# EasyEDA Pro project ProDoc_ICM_2025-08-29.epro, schematic Schematic1
Board Name: ICM; Create Date: 2025-08-23; Page Name: P1; Project Name: ICM module; Schematic Name: Schematic1; Update Date: 2025-08-24; Company: EasyEDA.com; Page Size: A4; Version: V1.0
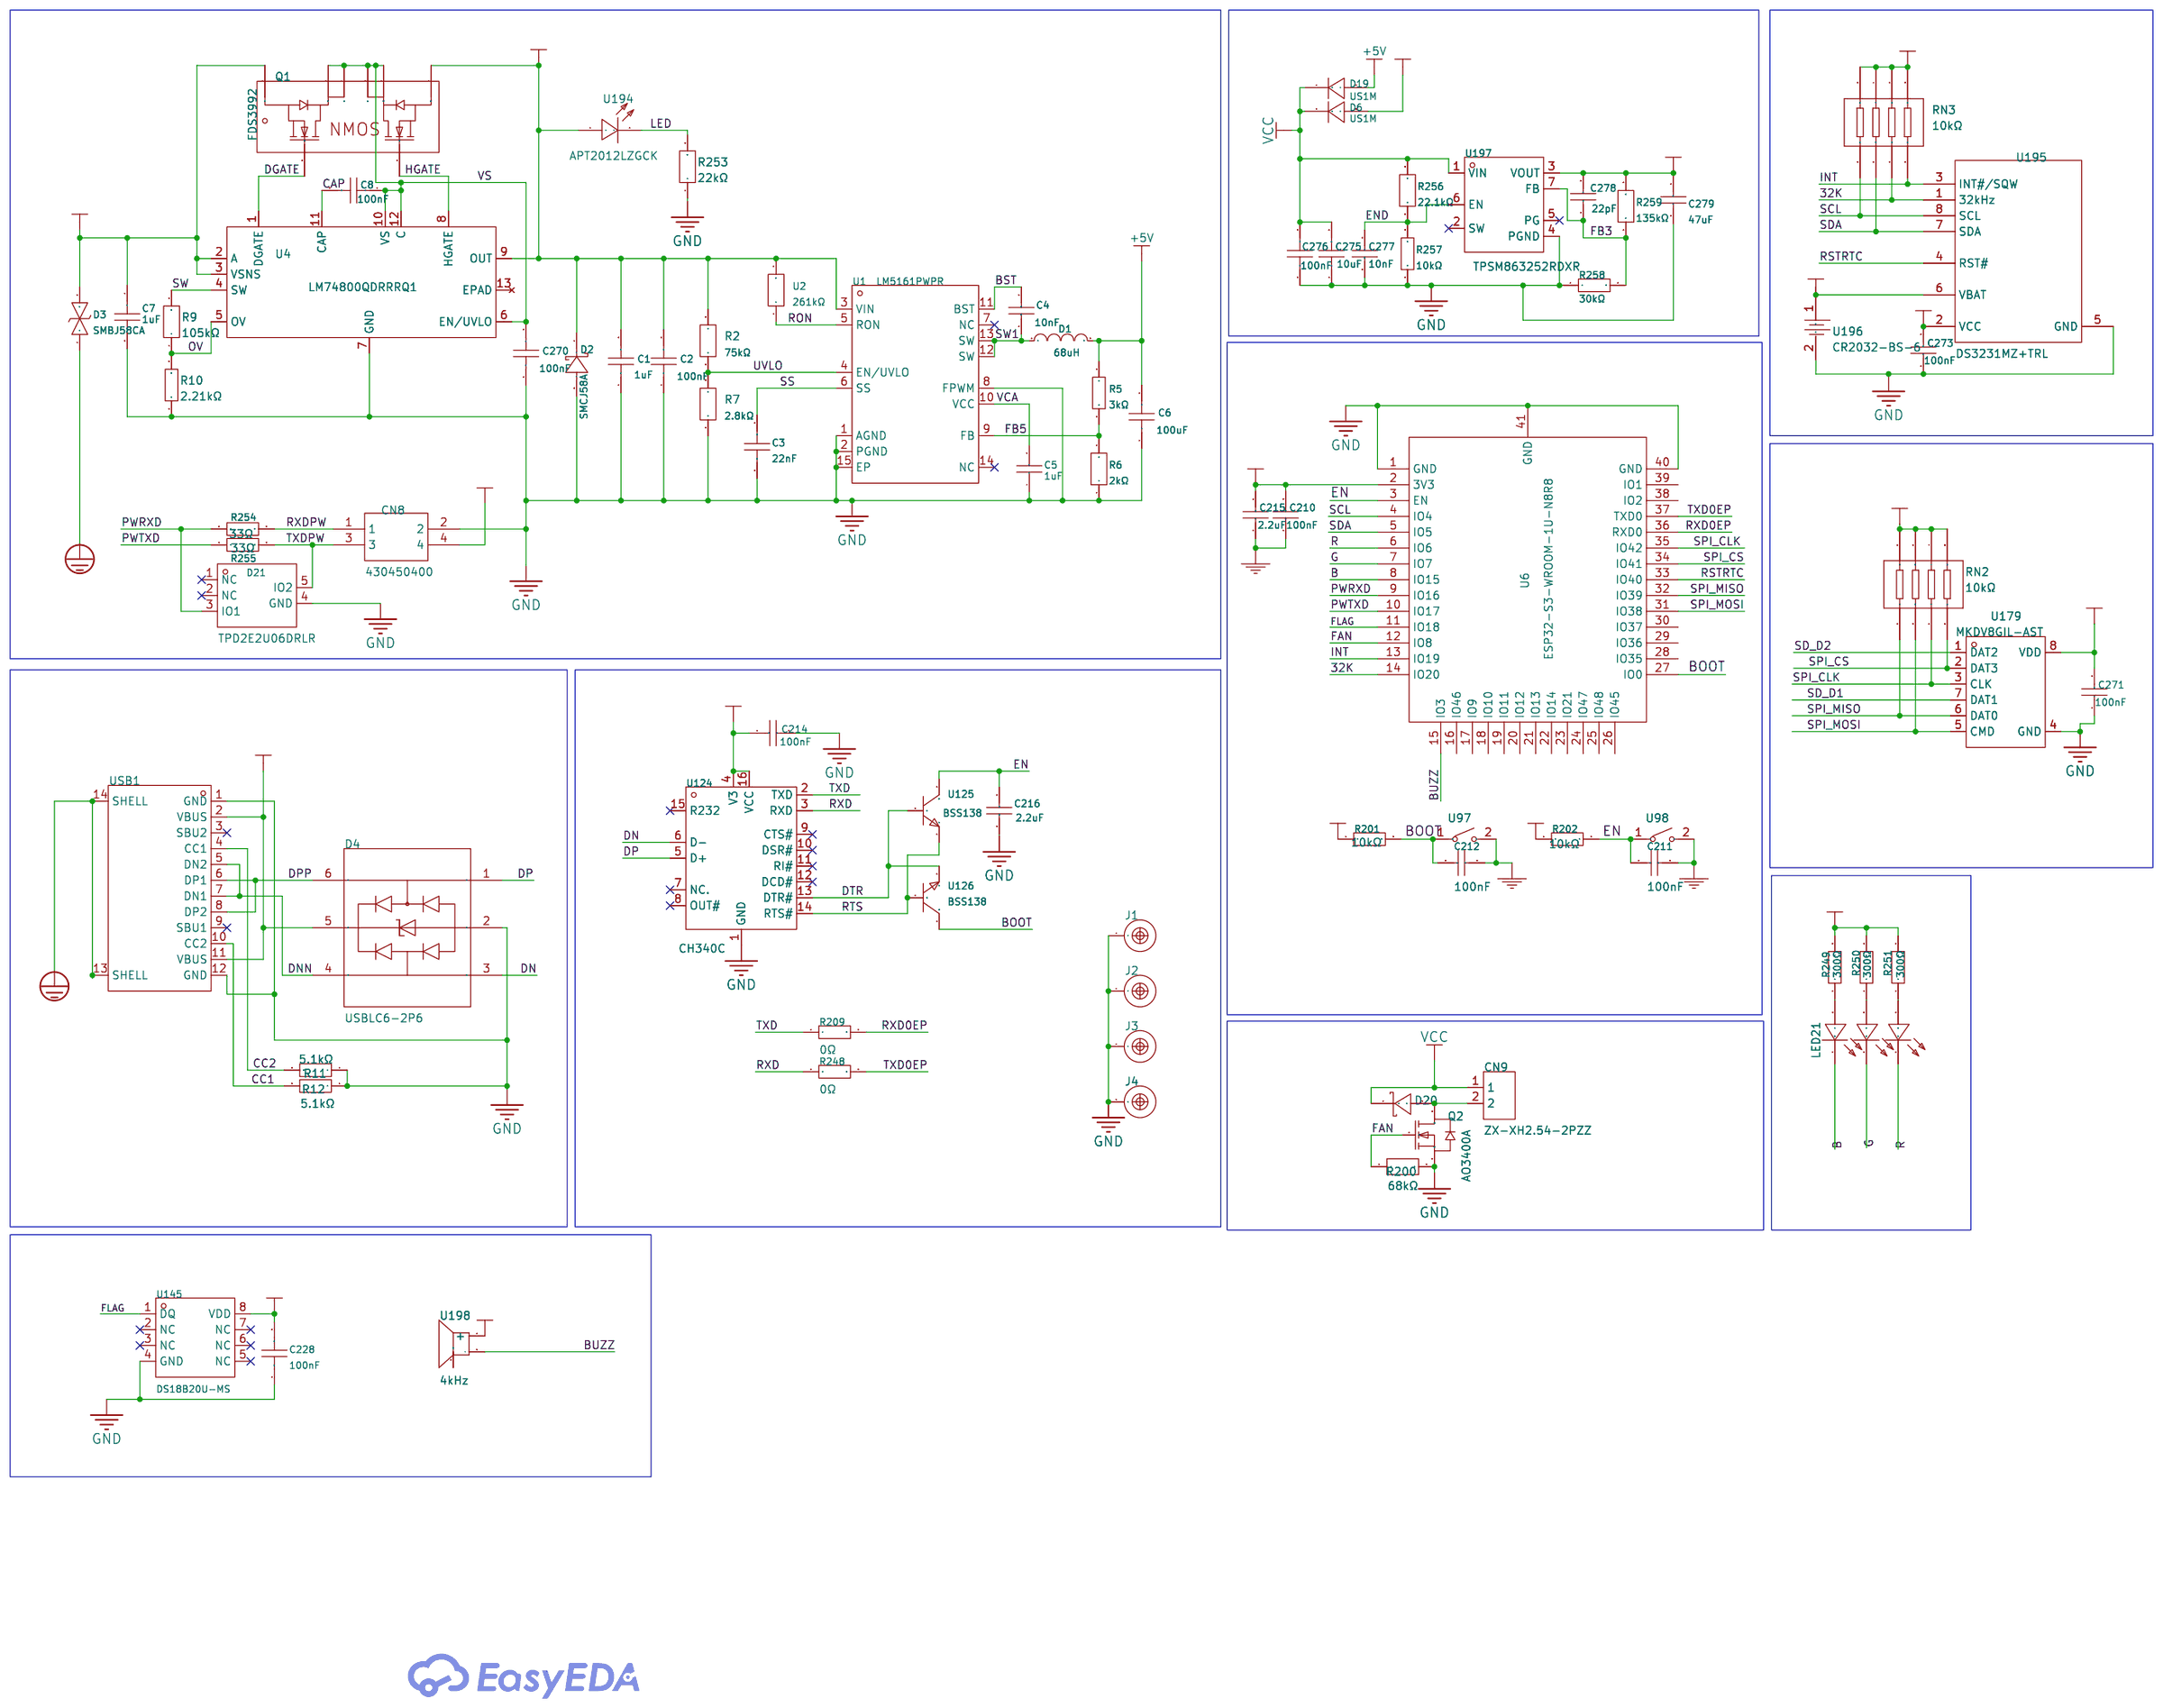
[diagram p0: schematic sheet]

## Parts
C1  1uF  [C2220]
C2  100nF  [C1210]
C3  22nF  [C0805]
C4  10nF  [C0402]
C5  1uF  [C0603]
C6  100uF  [C1210]
C7  1uF  [C2220]
C8  100nF  [C1210]
C210  100nF  [C0805]
C211  100nF  [C0805]
C212  100nF  [C0805]
C214  100nF  [C0805]
C215  2.2uF  [C0805]
C216  2.2uF  [C0805]
C228  100nF  [C0805]
C270  100nF  [C1210]
C271  100nF  [C0805]
C273  100nF  [C0805]
C275  10uF  [C0805]
C276  100nF  [C0402]
C277  10nF  [C0201]
C278  22pF  [C0201]
C279  47uF  [C1210]
CN8  430450400  [CONN-TH_0430450400]
CN9  ZX-XH2.54-2PZZ  [CONN-TH_2P-P2.50_HX25003-2A]
D1  68uH  [IND-SMD_L12.5-W12.5-SRR1280-150M]
D2  SMCJ58A  [SMC_L6.9-W5.8-LS7.9-RD]
D3  SMBJ58CA  [SMB_L4.6-W3.6-LS5.3-BI]
D4  USBLC6-2P6  [SOT-666-6_L1.6-W1.2-P0.50-LS1.6-BR]
D6  US1M  [SMA_L4.4-W2.8-LS5.4-RD]
D19  US1M  [SMA_L4.4-W2.8-LS5.4-RD]
D20  BAT46WJ,115  [SOD-323F_L2.0-W1.6-LS2.5-RD]
D21  TPD2E2U06DRLR  [SOT-553-5_L1.6-W1.2-P0.50-LS1.6-TL-1]
J1  SCREW-MOUNTING-HOLE-3MM  [MountingHole:MountingHole_2.7mm_M2.5_Pad_Via]
J2  SCREW-MOUNTING-HOLE-3MM  [MountingHole:MountingHole_2.7mm_M2.5_Pad_Via]
J3  SCREW-MOUNTING-HOLE-3MM  [MountingHole:MountingHole_2.7mm_M2.5_Pad_Via]
J4  SCREW-MOUNTING-HOLE-3MM  [MountingHole:MountingHole_2.7mm_M2.5_Pad_Via]
LED21  HL-AF-5060H271BU46FU79GC-S1-THL  [LED-ARRAY-SMD_6P-L5.4-W5.0-TL-FD]
Q1  FDS3992  [SO-8_L4.9-W3.9-P1.27-LS5.9-BL]
Q2  AO3400A  [SOT-23-3_L2.9-W1.6-P1.90-LS2.8-BR]
R2  75kΩ  [R1210]
R5  3kΩ  [R0603]
R6  2kΩ  [R0402]
R7  2.8kΩ  [R1210]
R9  105kΩ  [R1206]
R10  2.21kΩ  [R1206]
R11  5.1kΩ  [R0805]
R12  5.1kΩ  [R0805]
R200  68kΩ  [R1206]
R201  10kΩ  [R0805]
R202  10kΩ  [R0805]
R209  0Ω  [R0805]
R248  0Ω  [R0805]
R249  300Ω  [R0805]
R250  300Ω  [R0805]
R251  300Ω  [R0805]
R253  22kΩ  [R1210]
R254  33Ω  [R0805]
R255  33Ω  [R0805]
R256  22.1kΩ  [R0402]
R257  10kΩ  [R0402]
R258  30kΩ  [R0603]
R259  135kΩ  [R0603]
RN2  10kΩ  [RES-ARRAY-SMD_0603-8P-L3.2-W1.6-BL]
RN3  10kΩ  [RES-ARRAY-SMD_0603-8P-L3.2-W1.6-BL]
U1  LM5161PWPR  [HTSSOP-14_L5.0-W4.4-P0.65-LS6.4-BL-EP3.0]
U2  261kΩ  [R0402]
U4  LM74800QDRRRQ1  [WSON-12_L3.0-W3.0-P0.50-TL-EP-2]
U6  ESP32-S3-WROOM-1U-N8R8  [WIRELM-SMD_ESP32-S3-WROOM-1U]
U97  TD-1183SN-1.7H-250  [KEY-SMD_L3.0-W2.5-LS4.0]
U98  TD-1183SN-1.7H-250  [KEY-SMD_L3.0-W2.5-LS4.0]
U124  CH340C  [SOP-16_L10.0-W3.9-P1.27-LS6.0-BL]
U125  BSS138  [SOT-23-3_L2.9-W1.6-P1.90-LS2.8-BR]
U126  BSS138  [SOT-23-3_L2.9-W1.6-P1.90-LS2.8-BR]
U145  DS18B20U-MS  [MSOP-8_L3.0-W3.0-P0.65-LS4.9-BL-1]
U179  MKDV8GIL-AST  [LGA-8_L6.0-W8.0-P1.27-TL]
U194  APT2012LZGCK  [LED-SMD_L2.0-W1.3-R-RD]
U195  DS3231MZ+TRL  [SOIC-8_L4.9-W3.9-P1.27-LS6.0-BL]
U196  CR2032-BS-6  [BAT-TH_CR2032-BS-6-1]
U197  TPSM863252RDXR  [QFN-7_L4.0-W3.3_TPSM863257RDXR]
U198  4kHz  [BUZ-SMD_3P_L5.0-W5.0-P3.50-TL]
USB1  TYPE-C 16PIN 2MD(073)  [USB-C-SMD_TYPE-C-6PIN-2MD-073]

## Library data of the parts
C1 C7 = GRM55DR72E105KW01L: Capacitance: Tolerance:±10% Tolerance:±10% Voltage Rated: Temperature Coefficient:; LCSC Part Name: 1uF ±10% 250V; Supplier Part: C489791; Manufacturer: muRata(村田); Supplier Footprint: 2220; JLCPCB Part Class: Extended Part; Datasheet: https://atta.szlcsc.com/upload/public/pdf/source/20200303/C489791_21819A01F8644F985297DAC22D62BF33.pdf; Supplier: LCSC; Tolerance: ±10%
C2 C8 C270 = CC1210KKX7RYBB104: Capacitance: Tolerance:±10% Tolerance:±10% Voltage Rated: Temperature Coefficient:; LCSC Part Name: 100nF ±10% 250V; Supplier Part: C527381; Manufacturer: YAGEO(国巨); Supplier Footprint: 1210; JLCPCB Part Class: Extended Part; Datasheet: https://atta.szlcsc.com/upload/public/pdf/source/20200508/C527381_FB64CFF56C74B71B8CBBB2E2D2FF56B0.pdf; Supplier: LCSC; Tolerance: ±10%
C3 = CC0805KRX7R7BB223: Capacitance: Tolerance:±10% Tolerance:±10% Voltage Rated: Temperature Coefficient:; LCSC Part Name: 22nF ±10% 16V; Supplier Part: C519961; Manufacturer: YAGEO(国巨); Supplier Footprint: 0805; JLCPCB Part Class: Extended Part; Datasheet: https://atta.szlcsc.com/upload/public/pdf/source/20200423/C519961_BCF55CFF7AF7FA8FAC393D5C8451BEF7.pdf; Supplier: LCSC; Tolerance: ±10%
C4 = GRM155R71H103KA88D: Capacitance: Tolerance:±10% Tolerance:±10% Voltage Rated: Temperature Coefficient:; LCSC Part Name: 10nF ±10% 50V; Supplier Part: C77019; Manufacturer: muRata(村田); Supplier Footprint: 0402; JLCPCB Part Class: Extended Part; Datasheet: https://atta.szlcsc.com/upload/public/pdf/source/20180326/C77019_6A3693CE1BCE757D6A8B7C99DAE1B441.pdf; Supplier: LCSC; Tolerance: ±10%
C5 = EMK107B7105KA-T: Capacitance:1uF Tolerance:±10% Tolerance:±10% Voltage Rating:16V Temperature Coefficient:X7R; LCSC Part Name: MSASE168SB7105KTNA01 1uF ±10% 16V; Supplier Part: C92759; Manufacturer: TAIYO YUDEN(太诱); Supplier Footprint: 0603; JLCPCB Part Class: Extended Part; Datasheet: https://item.szlcsc.com/datasheet/EMK107B7105KA-T/93953.html; Supplier: LCSC; Tolerance: ±10%; Voltage Rating: 16V; Temperature Coefficient: X7R
C6 = GRM32ER60J107ME20L_C88154: Capacitance: Tolerance:±20% Tolerance:±20% Voltage Rated: Temperature Coefficient:; LCSC Part Name: 100uF ±20% 6.3V; Supplier Part: C88154; Manufacturer: muRata(村田); Manufacturer Part: GRM32ER60J107ME20L; Supplier Footprint: 1210; JLCPCB Part Class: Extended Part; Datasheet: https://atta.szlcsc.com/upload/public/pdf/source/20170116/1484561244372.pdf; Supplier: LCSC; Tolerance: ±20%
C210-C212 C214 C271 C273 = 0805B104K500NT: Capacitance:100nF Tolerance:±10% Tolerance:±10% Voltage Rated: Temperature Coefficient:; LCSC Part Name: 100nF ±10% 50V; Supplier Part: C38141; Manufacturer: FH(风华); Supplier Footprint: 0805; JLCPCB Part Class: Extended Part; Datasheet: https://atta.szlcsc.com/upload/public/pdf/source/20200305/C486355_26A10D38EF8C2A5C37091D0039909270.pdf; Supplier: LCSC; Tolerance: ±10%
C215 C216 = CL21B225KAFNNNE: Capacitance: Tolerance:±10% Tolerance:±10% Voltage Rated: Temperature Coefficient:; LCSC Part Name: 2.2uF ±10% 25V; Supplier Part: C19110; Manufacturer: SAMSUNG(三星); Supplier Footprint: 0805; JLCPCB Part Class: Extended Part; Datasheet: https://atta.szlcsc.com/upload/public/pdf/source/20160218/1457707763339.pdf; Supplier: LCSC; Tolerance: ±10%
C228 = GCM21BR71H104KA37K: Capacitance:0.1uF Tolerance:±10% Tolerance:±10% Voltage Rating:50V Temperature Coefficient:X7R; LCSC Part Name: 100nF ±10% 50V; Supplier Part: C28233; Manufacturer: muRata(村田); Supplier Footprint: 0805; JLCPCB Part Class: Extended Part; Datasheet: https://atta.szlcsc.com/upload/public/pdf/source/20230811/01F8D1403046F5B0772D3592B1B0BAA0.pdf; Supplier: LCSC; Tolerance: ±10%; Voltage Rating: 50V; Temperature Coefficient: X7R
C275 = C0805C106K8PACTU: Capacitance: Tolerance:±10% Tolerance:±10% Voltage Rated: Temperature Coefficient:; LCSC Part Name: 10uF ±10% 10V; Supplier Part: C2167673; Manufacturer: KEMET(基美); Supplier Footprint: 0805; JLCPCB Part Class: Extended Part; Datasheet: https://atta.szlcsc.com/upload/public/pdf/source/20210601/F69F25D6FEA5EB3D7C122B835EA50B80.pdf; Supplier: LCSC; Tolerance: ±10%
C276 = GRM155R71A104KA01D: Capacitance: Tolerance:±10% Tolerance:±10% Voltage Rated: Temperature Coefficient:; LCSC Part Name: 100nF ±10% 10V; Supplier Part: C71687; Manufacturer: muRata(村田); Supplier Footprint: 0402; JLCPCB Part Class: Extended Part; Datasheet: https://atta.szlcsc.com/upload/public/pdf/source/20180228/C71687_15198055953951377607.pdf; Supplier: LCSC; Tolerance: ±10%
C277 = GRM033R70J103KA01D: Capacitance: Tolerance:±10% Tolerance:±10% Voltage Rated: Temperature Coefficient:; LCSC Part Name: 10nF ±10% 6.3V; Supplier Part: C76940; Manufacturer: muRata(村田); Supplier Footprint: 0201; JLCPCB Part Class: Extended Part; Datasheet: https://atta.szlcsc.com/upload/public/pdf/source/20180307/C76940_15204091030811407728.pdf; Supplier: LCSC; Tolerance: ±10%
C278 = GRM0335C1E220JA01D: Capacitance: Tolerance:±5% Tolerance:±5% Voltage Rated: Temperature Coefficient:; LCSC Part Name: 22pF ±5% 25V; Supplier Part: C76919; Manufacturer: muRata(村田); Supplier Footprint: 0201; JLCPCB Part Class: Extended Part; Datasheet: https://atta.szlcsc.com/upload/public/pdf/source/20180307/C76919_15204090858141407709.pdf; Supplier: LCSC; Tolerance: ±5%
C279 = GRM32ER71A476KE15L: Capacitance: Tolerance:±10% Tolerance:±10% Voltage Rated: Temperature Coefficient:; LCSC Part Name: 47uF ±10% 10V; Supplier Part: C84494; Manufacturer: muRata(村田); Supplier Footprint: 1210; JLCPCB Part Class: Extended Part; Datasheet: https://atta.szlcsc.com/upload/public/pdf/source/20161226/1482720144456.pdf; Supplier: LCSC; Tolerance: ±10%
CN8 = 430450400_C122413: Pins Structure:2x2P Pitch:3mm Mounting Type:Right Angle Reference Series:Micro-Fit(MX 3.0) Number of Pins:4P Number of Rows:2 Number of PINs Per Row:2 Row Spacing:3mm Current Rating:8.5A Contact Material:Brass Contact Plating:Tin Operating Temperature:-40; LCSC Part Name: 2x2P 间距:3mm 弯插 系列:Micro-Fit(MX 3.0); Supplier Part: C122413; Manufacturer: MOLEX; Supplier Footprint: 弯插,P=3mm; JLCPCB Part Class: Extended Part; Datasheet: https://www.molex.com/content/dam/molex/molex-dot-com/products/automated/en-us/salesdrawingpdf/430/43045/430450400_sd.pdf?inline\; Supplier: LCSC; Pins Structure: 2x2P; Pitch: 3mm; Mounting Type: Right Angle; Reference Series: Micro-Fit(MX 3.0); Number of Pins: 4P; Number of Rows: 2; Number of PINs Per Row: 2; Row Spacing: 3mm; Current Rating: 8.5A; Contact Material: Brass; Contact Plating: Tin; Operating Temperature: -40℃~+105℃; Voltage Rating: 600V; Flame Retardant Rating: UL94V-0; Supplementary Features: Harpoon Contact (Plastic); Color: Black; Z-Height of the Board: 8.77mm; X-Length of Bottom Edge on Board (Spacing Line): 9.65mm; Y-Width of Bottom Edge on Board: 12.24mm
CN9 = ZX-XH2.54-2PZZ: Pins Structure:1x2P Pitch:2.5mm Mounting Type:Through Hole Reference Series:XH Number of Pins:2P Number of Rows:1 Number of PINs Per Row:2 Row Spacing:- Current Rating:3A Contact Material:Brass Contact Plating:Tin Operating Temperature:-25℃~+85℃ Operating; LCSC Part Name: 1x2P 间距:2.5mm 直插 系列:XH; Supplier Part: C7429632; Manufacturer: Megastar(兆星); Supplier Footprint: 插件,P=2.5mm; JLCPCB Part Class: Extended Part; Datasheet: https://item.szlcsc.com/datasheet/ZX-XH2.54-2PZZ/8427549.html; Supplier: LCSC; Pins Structure: 1x2P; Pitch: 2.5mm; Mounting Type: Through Hole; Reference Series: XH; Number of Pins: 2P; Number of Rows: 1; Number of PINs Per Row: 2; Current Rating: 3A; Contact Material: Brass; Contact Plating: Tin; Operating Temperature: -25℃~+85℃; Voltage Rating: 250V; Plastic Material: PA66; Flame Retardant Rating: UL94V-0; Color: White; Z-Height of the Board: 7mm; X-Length of Bottom Edge on Board (Spacing Line): 7.5mm; Y-Width of Bottom Edge on Board: 5.9mm
D1 = SRR1260-680M: Inductance:68uH Tolerance:±20% Tolerance:±20% Current Rating:2.1A Current - Saturation(Isat):2.1A DC Resistance(DCR):110mΩ Type:- Ratings:-; LCSC Part Name: 68uH ±20% 2.1A; Supplier Part: C2041353; Manufacturer: BOURNS; Supplier Footprint: SMD,12.5x12.5mm; JLCPCB Part Class: Extended Part; Datasheet: https://item.szlcsc.com/datasheet/SRR1260-680M/2132916.html; Supplier: LCSC; Tolerance: ±20%; Current Rating: 2.1A; Current - Saturation(Isat): 2.1A; DC Resistance(DCR): 110mΩ
D2 = SMCJ58A_C42371547: Polarity:Unidirectional Reverse Stand-Off Voltage (Vrwm):58V Clamping Voltage:93.6V Peak Pulse Current (Ipp):16.1A Peak Pulse Power Dissipation (Ppp):1.5kW Voltage - Breakdown:71.2V Reverse Leakage Current (Ir):1uA Operating Temperature:-55℃~+150℃ Operati; LCSC Part Name: 1500W 表面贴装瞬态电压抑制器; Supplier Part: C42371547; Manufacturer: 宏嘉诚; Supplier Footprint: SMC(DO-214AB); JLCPCB Part Class: Extended Part; Datasheet: https://item.szlcsc.com/datasheet/SMCJ58A/44252474.html; Supplier: LCSC; Polarity: Unidirectional; Reverse Stand-Off Voltage (Vrwm): 58V; Clamping Voltage: 93.6V; Peak Pulse Current (Ipp): 16.1A; Peak Pulse Power Dissipation (Ppp): 1.5kW; Voltage - Breakdown: 71.2V; Reverse Leakage Current (Ir): 1uA; Operating Temperature: -55℃~+150℃; level of protection: IEC 61000-4-2; Type: TVS
D3 = SMBJ58CA_C440309: Polarity:Bidirectional Reverse Stand-Off Voltage (Vrwm):58V Clamping Voltage:93.6V Peak Pulse Current (Ipp):6.4A Peak Pulse Power Dissipation (Ppp):600W@10/1000us Voltage - Breakdown:64.4V Reverse Leakage Current (Ir):5uA Operating Temperature:-55℃~+150℃; LCSC Part Name: 双向TVS 58V截止 峰值浪涌电流：6.4A; Supplier Part: C440309; Manufacturer: AnBon(安邦); Supplier Footprint: SMB(DO-214AA); JLCPCB Part Class: Extended Part; Datasheet: https://item.szlcsc.com/datasheet/SMBJ58CA/439717.html; Supplier: LCSC; Polarity: Bidirectional; Reverse Stand-Off Voltage (Vrwm): 58V; Clamping Voltage: 93.6V; Peak Pulse Current (Ipp): 6.4A; Peak Pulse Power Dissipation (Ppp): 600W@10/1000us; Voltage - Breakdown: 64.4V; Reverse Leakage Current (Ir): 5uA; Operating Temperature: -55℃~+150℃; Type: TVS
D4 = USBLC6-2P6_C15999: polarity:Unidirectional Reverse Stand-Off Voltage (Vrwm):5.25V Maximum Clamping Voltage:17V Peak Pulse Current (Ipp):5A Breakdown Voltage:6V Number of Lines:Dual channel Type:ESD; LCSC Part Name: 单向ESD; Supplier Part: C15999; Manufacturer: ST(意法半导体); Supplier Footprint: SOT-666-6; JLCPCB Part Class: Extended Part; Datasheet: https://atta.szlcsc.com/upload/public/pdf/source/20140724/1457707160627.pdf; Supplier: LCSC; polarity: Unidirectional; Reverse Stand-Off Voltage (Vrwm): 5.25V; Maximum Clamping Voltage: 17V; Peak Pulse Current (Ipp): 5A; Breakdown Voltage: 6V; Number of Lines: Dual channel; Type: ESD
D6 D19 = US1M_C412437: Diode Configuration:Independent Type Forward Voltage (Vf@If):1.65V@1A Reverse Voltage (Vr): Rectified Current: Reverse Leakage Current:5uA@1kV Reverse Recovery Time (trr): Operating Temperature:-55℃~+150℃@(Tj) Operating Temperature:-55℃~+150℃@(Tj); LCSC Part Name: 电压:1kV 电流:1A; Supplier Part: C412437; Manufacturer: MDD(辰达半导体); Supplier Footprint: SMA; JLCPCB Part Class: Basic Part; Datasheet: https://atta.szlcsc.com/upload/public/pdf/source/20240710/67F2BD91F54C3EE0CEC9BDDD003BC3A0.pdf; Supplier: LCSC; Diode Configuration: Independent Type; Forward Voltage (Vf@If): 1.65V@1A; Reverse Leakage Current: 5uA@1kV; Operating Temperature: -55℃~+150℃@(Tj)
D20 = BAT46WJ,115: Forward Voltage (Vf@If):850mV@250mA Reverse Voltage (Vr):100V Average Rectified Current (Io):250mA Reverse Leakage Current (Ir):9uA@100V; LCSC Part Name: 电压:100V 电流:250mA; Supplier Part: C114696; Manufacturer: Nexperia(安世); Supplier Footprint: SOD-323F; JLCPCB Part Class: Extended Part; Datasheet: https://atta.szlcsc.com/upload/public/pdf/source/20170620/1497944776306.pdf; Supplier: LCSC; Forward Voltage (Vf@If): 850mV@250mA; Reverse Voltage (Vr): 100V; Average Rectified Current (Io): 250mA; Reverse Leakage Current (Ir): 9uA@100V
D21 = TPD2E2U06DRLR: Reverse Stand-Off Voltage (Vrwm):5.5V Clamping Voltage:12.4V Peak Pulse Current (Ipp):5.5A@8/20us Peak Pulse Power Dissipation (Ppp):85W@8/20us Voltage - Breakdown:6.5V Reverse Leakage Current (Ir):10nA Number of Channels:2 Operating Temperature:-40℃~+125; Supplier Part: C1972959; Manufacturer: TI(德州仪器); Supplier Footprint: SOT-553-5; JLCPCB Part Class: Extended Part; Datasheet: https://www.ti.com/cn/lit/gpn/tpd2e2u06; Supplier: LCSC; Reverse Stand-Off Voltage (Vrwm): 5.5V; Clamping Voltage: 12.4V; Peak Pulse Current (Ipp): 5.5A@8/20us; Peak Pulse Power Dissipation (Ppp): 85W@8/20us; Voltage - Breakdown: 6.5V; Reverse Leakage Current (Ir): 10nA; Number of Channels: 2; Operating Temperature: -40℃~+125℃; level of protection: IEC 61000-4-5；IEC 61000-4-2; Type: ESD; Junction Capacitance: 1.5pF
J1-J4 = SCREW-MOUNTING-HOLE-3MM
LED21 = HL-AF-5060H271BU46FU79GC-S1-THL: Supplier Part: C219409; Manufacturer: HONGLITRONIC(鸿利光电); Supplier Footprint: SMD5050; JLCPCB Part Class: Extended Part; Datasheet: https://atta.szlcsc.com/upload/public/pdf/source/20180503/C219409_0CFE42153F672A4C05B1C40D14E85291.pdf; Supplier: LCSC
Q1 = FDS3992: Number:2 N-Channel Drain to Source Voltage:100V Current - Continuous Drain(Id):4.5A RDS(on):- Pd - Power Dissipation:2.5W Gate Threshold Voltage (Vgs(th)):2V Gate Charge(Qg):11nC@10V Input Capacitance(Ciss):750pF@25V Reverse Transfer Capacitance (Crss@Vds; LCSC Part Name: 2个N沟道 耐压:100V 电流:4.5A; Supplier Part: C512899; Manufacturer: onsemi(安森美); Supplier Footprint: SO-8; JLCPCB Part Class: Extended Part; Datasheet: https://item.szlcsc.com/datasheet/FDS3992/527575.html; Supplier: LCSC; Number: 2 N-Channel; Drain to Source Voltage: 100V; Current - Continuous Drain(Id): 4.5A; Pd - Power Dissipation: 2.5W; Gate Threshold Voltage (Vgs(th)): 2V; Gate Charge(Qg): 11nC@10V; Input Capacitance(Ciss): 750pF@25V; Reverse Transfer Capacitance (Crss@Vds): 27pF@25V; Operating Temperature: -55℃~+150℃
Q2 = AO3400A_C5379092: Type:1 N-Channel Drain Source Voltage (Vdss): Continuous Drain Current (Id): Drain Source On Resistance (RDS(on)@Vgs,Id):20mΩ@10V,5A Power Dissipation (Pd): Gate Threshold Voltage (Vgs(th)@Id):1.2V@250uA Total Gate Charge (Qg@Vgs):4.1nC@10V Input Capacita; LCSC Part Name: 1个N沟道 耐压:30V 电流:5.8A; Supplier Part: C5379092; Manufacturer: MSKSEMI(美森科); Supplier Footprint: SOT-23-3L; JLCPCB Part Class: Extended Part; Datasheet: https://atta.szlcsc.com/upload/public/pdf/source/20241113/12FF27F8B99F921F6260393F7E001EE2.pdf; Supplier: LCSC; Type: 1 N-Channel; Drain Source On Resistance (RDS(on)@Vgs,Id): 20mΩ@10V,5A; Gate Threshold Voltage (Vgs(th)@Id): 1.2V@250uA; Total Gate Charge (Qg@Vgs): 4.1nC@10V; Input Capacitance (Ciss@Vds): 345pF@25V; Reverse Transfer Capacitance (Crss@Vds): 32pF@25V; Operating Temperature: -55℃~+150℃
R2 = AC1210FR-0775KL: Type:Thick Film Resistors Resistance: Tolerance:±1% Tolerance:±1% Power(Watts): Overload Voltage (Max): Temperature Coefficient:±100ppm/℃ Temperature Coefficient:±100ppm/℃ Operating Temperature Range:-55℃~+155℃ Operating Temperature Range:-55℃~+155℃; LCSC Part Name: 厚膜电阻 75kΩ ±1% 500mW; Supplier Part: C230340; Manufacturer: YAGEO(国巨); Supplier Footprint: 1210; JLCPCB Part Class: Extended Part; Datasheet: https://atta.szlcsc.com/upload/public/pdf/source/20191108/C230504_7FB43CAE7E86B3B2980C2491161B254C.pdf; Supplier: LCSC; Type: Thick Film Resistors; Tolerance: ±1%; Temperature Coefficient: ±100ppm/℃; Operating Temperature Range: -55℃~+155℃
R5 = RC0603FR-073KL: Type:Thick Film Resistors Resistance:3kΩ Tolerance:±1% Tolerance:±1% Power(Watts):100mW Voltage-Supply(Max):75V Temperature Coefficient:±100ppm/℃ Temperature Coefficient:±100ppm/℃ Operating Temperature:-55℃~+155℃ Operating Temperature:-55℃~+155℃; LCSC Part Name: 厚膜电阻 3kΩ ±1% 100mW; Supplier Part: C126358; Manufacturer: YAGEO(国巨); Supplier Footprint: 0603; JLCPCB Part Class: Extended Part; Datasheet: https://atta.szlcsc.com/upload/public/pdf/source/20170914/C127450_1505359406912967677.pdf; Supplier: LCSC; Type: Thick Film Resistors; Tolerance: ±1%; Power(Watts): 100mW; Voltage-Supply(Max): 75V; Temperature Coefficient: ±100ppm/℃; Operating Temperature: -55℃~+155℃
R6 = CRCW04022K00FKED: Type:Thick Film Resistors Resistance: Tolerance:±1% Tolerance:±1% Power(Watts): Overload Voltage (Max): Temperature Coefficient:±100ppm/℃ Temperature Coefficient:±100ppm/℃ Operating Temperature Range:-55℃~+155℃ Operating Temperature Range:-55℃~+155℃; LCSC Part Name: 厚膜电阻 2kΩ ±1% 62.5mW; Supplier Part: C482125; Manufacturer: VISHAY(威世); Supplier Footprint: 0402; JLCPCB Part Class: Extended Part; Datasheet: https://atta.szlcsc.com/upload/public/pdf/source/20200618/C481956_E25174B008CE8C884BEDD7D4D15E674F.pdf; Supplier: LCSC; Type: Thick Film Resistors; Tolerance: ±1%; Temperature Coefficient: ±100ppm/℃; Operating Temperature Range: -55℃~+155℃
R7 = AC1210FR-072K8L: Type:Thick Film Resistors Resistance: Tolerance:±1% Tolerance:±1% Power(Watts): Overload Voltage (Max): Temperature Coefficient:±100ppm/℃ Temperature Coefficient:±100ppm/℃ Operating Temperature Range:-55℃~+155℃ Operating Temperature Range:-55℃~+155℃; LCSC Part Name: 厚膜电阻 2.8kΩ ±1% 500mW; Supplier Part: C230171; Manufacturer: YAGEO(国巨); Supplier Footprint: 1210; JLCPCB Part Class: Extended Part; Datasheet: https://atta.szlcsc.com/upload/public/pdf/source/20191108/C230504_7FB43CAE7E86B3B2980C2491161B254C.pdf; Supplier: LCSC; Type: Thick Film Resistors; Tolerance: ±1%; Temperature Coefficient: ±100ppm/℃; Operating Temperature Range: -55℃~+155℃
R9 = RC1206FR-07105KL: Type:Thick Film Resistor Resistance:105kΩ Tolerance:±1% Tolerance:±1% Power(Watts):250mW Voltage-Supply(Max):200V Temperature Coefficient:±100ppm/℃ Temperature Coefficient:±100ppm/℃ Operating Temperature:-55℃~+155℃ Operating Temperature:-55℃~+155℃; LCSC Part Name: 厚膜电阻 105kΩ ±1% 250mW; Supplier Part: C488616; Manufacturer: YAGEO(国巨); Supplier Footprint: 1206; JLCPCB Part Class: Extended Part; Datasheet: https://atta.szlcsc.com/upload/public/pdf/source/20250610/89E4D743C004A82A45145C7A2CC3A578.pdf; Supplier: LCSC; Type: Thick Film Resistor; Tolerance: ±1%; Power(Watts): 250mW; Voltage-Supply(Max): 200V; Temperature Coefficient: ±100ppm/℃; Operating Temperature: -55℃~+155℃
R10 = AC1206FR-072K21L: Type:Thick Film Resistors Resistance: Tolerance:±1% Tolerance:±1% Power(Watts):250mW Overload Voltage (Max): Temperature Coefficient:±100ppm/℃ Temperature Coefficient:±100ppm/℃ Operating Temperature Range:-55℃~+155℃ Operating Temperature Range:-55℃~+155℃; LCSC Part Name: 厚膜电阻 2.21kΩ ±1% 250mW; Supplier Part: C229508; Manufacturer: YAGEO(国巨); Supplier Footprint: 1206; JLCPCB Part Class: Extended Part; Datasheet: https://atta.szlcsc.com/upload/public/pdf/source/20180927/C229861_4ABDC471507C1ED6AFB4BA66AFC8620A.pdf; Supplier: LCSC; Type: Thick Film Resistors; Tolerance: ±1%; Power(Watts): 250mW; Temperature Coefficient: ±100ppm/℃; Operating Temperature Range: -55℃~+155℃
R11 R12 = 0805W8F5101T5E: Type:Thick Film Resistor Resistance:5.1kΩ Tolerance:±1% Tolerance:±1% Power(Watts):125mW Voltage-Supply(Max):150V Temperature Coefficient:±100ppm/℃ Temperature Coefficient:±100ppm/℃ Operating Temperature:-55℃~+155℃ Operating Temperature:-55℃~+155℃; LCSC Part Name: 5.1kΩ ±1% 125mW 厚膜电阻; Supplier Part: C27834; Manufacturer: UNI-ROYAL(厚声); Supplier Footprint: 0805; JLCPCB Part Class: Basic Part; Datasheet: https://item.szlcsc.com/datasheet/0805W8F5101T5E/28584.html; Supplier: LCSC; Type: Thick Film Resistor; Tolerance: ±1%; Power(Watts): 125mW; Voltage-Supply(Max): 150V; Temperature Coefficient: ±100ppm/℃; Operating Temperature: -55℃~+155℃
R200 = RT1206BRD0768KL: Type:Thin Film Resistor Resistance: Tolerance:±0.1% Tolerance:±0.1% Power(Watts):250mW Overload Voltage (Max): Temperature Coefficient:±25ppm/℃ Temperature Coefficient:±25ppm/℃ Operating Temperature Range:-55℃~+155℃ Operating Temperature Range:-55℃~+155℃; LCSC Part Name: 薄膜电阻 68kΩ ±0.1% 250mW; Supplier Part: C706422; Manufacturer: YAGEO(国巨); Supplier Footprint: 1206; JLCPCB Part Class: Extended Part; Datasheet: https://atta.szlcsc.com/upload/public/pdf/source/20200720/C706422_759B829B0D18A4900E8B43DA140C33CB.pdf; Supplier: LCSC; Type: Thin Film Resistor; Tolerance: ±0.1%; Power(Watts): 250mW; Temperature Coefficient: ±25ppm/℃; Operating Temperature Range: -55℃~+155℃
R201 R202 = 0805W8F1002T5E: Type:Thick Film Resistors Resistance:10kΩ Tolerance:±1% Tolerance:±1% Power(Watts): Overload Voltage (Max): Temperature Coefficient:±100ppm/℃ Temperature Coefficient:±100ppm/℃ Operating Temperature Range:-55℃~+155℃ Operating Temperature Range:-55℃~+155℃; LCSC Part Name: 10kΩ ±1% 125mW 厚膜电阻; Supplier Part: C17414; Manufacturer: UNI-ROYAL(厚声); Supplier Footprint: 0805; JLCPCB Part Class: Basic Part; Datasheet: https://atta.szlcsc.com/upload/public/pdf/source/20200306/C422600_1E6D84923E4A46A82E41ADD87F860B5C.pdf; Supplier: LCSC; Type: Thick Film Resistors; Tolerance: ±1%; Temperature Coefficient: ±100ppm/℃; Operating Temperature Range: -55℃~+155℃
R209 R248 = 0805W8F0000T5E_C17477: Type:Thick Film Resistors Resistance: Tolerance:±1% Tolerance:±1% Power(Watts): Overload Voltage (Max): Temperature Coefficient:±800ppm/℃ Temperature Coefficient:±800ppm/℃ Operating Temperature Range:-55℃~+155℃ Operating Temperature Range:-55℃~+155℃; LCSC Part Name: 0Ω ±1% 125mW 厚膜电阻; Supplier Part: C17477; Manufacturer: UNI-ROYAL(厚声); Manufacturer Part: 0805W8F0000T5E; Supplier Footprint: 0805; JLCPCB Part Class: Basic Part; Datasheet: https://atta.szlcsc.com/upload/public/pdf/source/20200306/C422600_1E6D84923E4A46A82E41ADD87F860B5C.pdf; Supplier: LCSC; Type: Thick Film Resistors; Tolerance: ±1%; Temperature Coefficient: ±800ppm/℃; Operating Temperature Range: -55℃~+155℃
R249-R251 = 0805W8F3000T5E: Type:Thick Film Resistor Resistance:300Ω Tolerance:±1% Tolerance:±1% Power(Watts):125mW Voltage-Supply(Max):150V Temperature Coefficient:±100ppm/℃ Temperature Coefficient:±100ppm/℃ Operating Temperature:-55℃~+155℃ Operating Temperature:-55℃~+155℃; LCSC Part Name: 300Ω ±1% 125mW 厚膜电阻; Supplier Part: C17617; Manufacturer: UNI-ROYAL(厚声); Supplier Footprint: 0805; JLCPCB Part Class: Basic Part; Datasheet: https://item.szlcsc.com/datasheet/0805W8F3000T5E/18305.html; Supplier: LCSC; Type: Thick Film Resistor; Tolerance: ±1%; Power(Watts): 125mW; Voltage-Supply(Max): 150V; Temperature Coefficient: ±100ppm/℃; Operating Temperature: -55℃~+155℃
R253 = AC1210FR-0722KL: Type:Thick Film Resistor Resistance:22kΩ Tolerance:±1% Tolerance:±1% Power(Watts):500mW Voltage-Supply(Max):200V Temperature Coefficient:±100ppm/℃ Temperature Coefficient:±100ppm/℃ Operating Temperature:-55℃~+155℃ Operating Temperature:-55℃~+155℃; LCSC Part Name: 厚膜电阻 22kΩ ±1% 500mW; Supplier Part: C230119; Manufacturer: YAGEO(国巨); Supplier Footprint: 1210; JLCPCB Part Class: Extended Part; Datasheet: https://atta.szlcsc.com/upload/public/pdf/source/20241120/4D446B3946E6DC27047BD586A1D384B4.pdf; Supplier: LCSC; Type: Thick Film Resistor; Tolerance: ±1%; Power(Watts): 500mW; Voltage-Supply(Max): 200V; Temperature Coefficient: ±100ppm/℃; Operating Temperature: -55℃~+155℃
R254 R255 = 0805W8F330JT5E: Type:Thick Film Resistor Resistance:33Ω Tolerance:±1% Tolerance:±1% Power(Watts):125mW Voltage-Supply(Max):150V Temperature Coefficient:±200ppm/℃ Temperature Coefficient:±200ppm/℃ Operating Temperature:-55℃~+155℃ Operating Temperature:-55℃~+155℃; LCSC Part Name: 33Ω ±1% 125mW 厚膜电阻; Supplier Part: C17634; Manufacturer: UNI-ROYAL(厚声); Supplier Footprint: 0805; JLCPCB Part Class: Basic Part; Datasheet: https://item.szlcsc.com/datasheet/0805W8F330JT5E/18322.html; Supplier: LCSC; Type: Thick Film Resistor; Tolerance: ±1%; Power(Watts): 125mW; Voltage-Supply(Max): 150V; Temperature Coefficient: ±200ppm/℃; Operating Temperature: -55℃~+155℃
R256 = CRCW040222K1FKED: Type:Thick Film Resistors Resistance:22.1kΩ Tolerance:±1% Tolerance:±1% Power(Watts):62.5mW Voltage-Supply(Max):50V Temperature Coefficient:±100ppm/℃ Temperature Coefficient:±100ppm/℃ Operating Temperature:-55℃~+155℃ Operating Temperature:-55℃~+155℃; LCSC Part Name: 厚膜电阻 22.1kΩ ±1% 62.5mW; Supplier Part: C844504; Manufacturer: VISHAY(威世); Supplier Footprint: 0402; JLCPCB Part Class: Extended Part; Datasheet: https://atta.szlcsc.com/upload/public/pdf/source/20200927/C844919_23E7F5DF28E9421F105631C5C2D28736.pdf; Supplier: LCSC; Type: Thick Film Resistors; Tolerance: ±1%; Power(Watts): 62.5mW; Voltage-Supply(Max): 50V; Temperature Coefficient: ±100ppm/℃; Operating Temperature: -55℃~+155℃
R257 = CRCW040210K0FKED: Type:Thick Film Resistors Resistance:10kΩ Tolerance:±1% Tolerance:±1% Power(Watts):63mW Voltage-Supply(Max):50V Temperature Coefficient:±100ppm/℃ Temperature Coefficient:±100ppm/℃ Operating Temperature:-55℃~+155℃ Operating Temperature:-55℃~+155℃; LCSC Part Name: 厚膜电阻 10kΩ ±1% 63mW; Supplier Part: C71617; Manufacturer: VISHAY(威世); Supplier Footprint: 0402; JLCPCB Part Class: Extended Part; Datasheet: https://atta.szlcsc.com/upload/public/pdf/source/20180420/C190124_A776A444B598E5893D919B5902899056.pdf; Supplier: LCSC; Type: Thick Film Resistors; Tolerance: ±1%; Power(Watts): 63mW; Voltage-Supply(Max): 50V; Temperature Coefficient: ±100ppm/℃; Operating Temperature: -55℃~+155℃
R258 = RC0603FR-0730KL: Type:Thick Film Resistor Resistance:30kΩ Tolerance:±1% Tolerance:±1% Power(Watts):100mW Voltage-Supply(Max):75V Temperature Coefficient:±100ppm/℃ Temperature Coefficient:±100ppm/℃ Operating Temperature:-55℃~+155℃ Operating Temperature:-55℃~+155℃; LCSC Part Name: 厚膜电阻 30kΩ ±1% 100mW; Supplier Part: C100001; Manufacturer: YAGEO(国巨); Supplier Footprint: 0603; JLCPCB Part Class: Extended Part; Datasheet: https://atta.szlcsc.com/upload/public/pdf/source/20250610/89E4D743C004A82A45145C7A2CC3A578.pdf; Supplier: LCSC; Type: Thick Film Resistor; Tolerance: ±1%; Power(Watts): 100mW; Voltage-Supply(Max): 75V; Temperature Coefficient: ±100ppm/℃; Operating Temperature: -55℃~+155℃
R259 = RT0603BRD07135KL: Type:Thin Film Resistor Resistance: Tolerance:±0.1% Tolerance:±0.1% Power(Watts): Temperature Coefficient:±25ppm/℃ Temperature Coefficient:±25ppm/℃ Operating Temperature Range:-55℃~+155℃ Operating Temperature Range:-55℃~+155℃; LCSC Part Name: 薄膜电阻 135kΩ ±0.1% 100mW; Supplier Part: C861113; Manufacturer: YAGEO(国巨); Supplier Footprint: 0603; JLCPCB Part Class: Extended Part; Datasheet: https://atta.szlcsc.com/upload/public/pdf/source/20200610/C326738_5639A9F1B6EB6E4AE2197577D3456E7F.pdf; Supplier: LCSC; Type: Thin Film Resistor; Tolerance: ±0.1%; Temperature Coefficient: ±25ppm/℃; Operating Temperature Range: -55℃~+155℃
RN2 RN3 = 4D03WGJ0103T5E: Number of Resistors: Resistance:10kΩ Tolerance:±5% Tolerance:±5% Power(Watts): Temperature Coefficient:±200ppm/℃ Temperature Coefficient:±200ppm/℃ Number of Pins:; LCSC Part Name: 10kΩ ±5%; Supplier Part: C29718; Manufacturer: UNI-ROYAL(厚声); Supplier Footprint: 0603x4; JLCPCB Part Class: Basic Part; Datasheet: https://atta.szlcsc.com/upload/public/pdf/source/20191224/C474318_2527498AE30E813171187CCD28401A71.pdf; Supplier: LCSC; Tolerance: ±5%; Temperature Coefficient: ±200ppm/℃
U1 = LM5161PWPR: Function:Step-down type Output Type:Adjustable Input Voltage:4.5V~100V Input Voltage:4.5V~100V Output Voltage:2V~92V Output Voltage:2V~92V Output Current:1A Switching Frequency:1MHz Switching Frequency:1MHz Operating Temperature:-40℃~+125℃@(TJ) Operating; LCSC Part Name: 100V 1A 同步降压转换器; Supplier Part: C468246; Manufacturer: TI(德州仪器); Supplier Footprint: HTSSOP-14-EP; JLCPCB Part Class: Extended Part; Datasheet: https://www.ti.com/cn/lit/gpn/lm5161; Supplier: LCSC; Function: Step-down type; Output Type: Adjustable; Input Voltage: 4.5V~100V; Output Voltage: 2V~92V; Output Current: 1A; Switching Frequency: 1MHz; Operating Temperature: -40℃~+125℃@(TJ); Synchronous Rectification: Yes; Number of Outputs: 1; Topology: Step-down；Flyback; Switch tube (built-in/external): Built-in
U2 = CRCW0402261KFKED: Type:Thick Film Resistors Resistance: Tolerance:±1% Tolerance:±1% Power(Watts): Overload Voltage (Max): Temperature Coefficient:±100ppm/℃ Temperature Coefficient:±100ppm/℃ Operating Temperature:-55℃~+155℃ Operating Temperature:-55℃~+155℃; LCSC Part Name: 厚膜电阻 261kΩ ±1% 62.5mW; Supplier Part: C2076807; Manufacturer: VISHAY(威世); Supplier Footprint: 0402; JLCPCB Part Class: Extended Part; Datasheet: https://atta.szlcsc.com/upload/public/pdf/source/20210503/4CAD3FA9B4C9A749933C1C52DBF827C2.pdf; Supplier: LCSC; Type: Thick Film Resistors; Tolerance: ±1%; Temperature Coefficient: ±100ppm/℃; Operating Temperature: -55℃~+155℃
U4 = LM74800QDRRRQ1: Maximum Continuous Current:2.6A Voltage - Supply:3V~65V Voltage - Supply:3V~65V Operating Temperature	-:-40℃~+125℃ Operating Temperature	-:-40℃~+125℃; Supplier Part: C3215600; Manufacturer: TI(德州仪器); Supplier Footprint: SON-12(3x3); JLCPCB Part Class: Extended Part; Datasheet: https://www.ti.com/cn/lit/gpn/lm7480-q1; Supplier: LCSC; Maximum Continuous Current: 2.6A; Voltage - Supply: 3V~65V; Operating Temperature	-: -40℃~+125℃
U6 = ESP32-S3-WROOM-1U-N8R8: LCSC Part Name: 通用型Wi-Fi+低功耗蓝牙MCU模组; Supplier Part: C2980300; Manufacturer: ESPRESSIF(乐鑫); Supplier Footprint: SMD,18x19.2mm; JLCPCB Part Class: Extended Part; Datasheet: https://item.szlcsc.com/datasheet/ESP32-S3-WROOM-1U-N8R8/3401552.html; Supplier: LCSC
U97 U98 = TD-1183SN-1.7H-250: LCSC Part Name: 小型正按轻触开关无柱 250gf H1.8; Supplier Part: C2905195; Manufacturer: DEALON(德艺隆); Supplier Footprint: SMD,2.5x3mm; JLCPCB Part Class: Extended Part; Datasheet: https://atta.szlcsc.com/upload/public/pdf/source/20220901/31B45DB5661394D4632E3F23E0E23353.pdf; Supplier: LCSC
U124 = CH340C: Applications Function:Transceiver Protocol: Supply Voltage:3.3V；5V Supply Voltage:3.3V；5V Data Rate:2Mbps; Supplier: LCSC; Manufacturer: WCH(南京沁恒); Supplier Part: C84681; JLCPCB Part Class: Extended Part; LCSC Part Name: CH340C USB转串口芯片 CH340; Supplier Footprint: SOP-16; Datasheet: https://atta.szlcsc.com/upload/public/pdf/source/20200819/C84681_ADBED554CE321879DBD6B1D06488689C.pdf; Applications Function: Transceiver; Supply Voltage: 3.3V；5V; Data Rate: 2Mbps
U125 U126 = BSS138_C5250986: Supplier Part: C5250986; Manufacturer: TWGMC(台湾迪嘉); Supplier Footprint: SOT-23; JLCPCB Part Class: Extended Part; Datasheet: https://atta.szlcsc.com/upload/public/pdf/source/20221109/9ADA114E38717C662A3131D5642C5082.pdf; Supplier: LCSC
U145 = DS18B20U-MS: Supplier Part: C22360666; Manufacturer: MSKSEMI(美森科); Supplier Footprint: MSOP-8; JLCPCB Part Class: Extended Part; Datasheet: https://atta.szlcsc.com/upload/public/pdf/source/20240508/6DE6BC45C23643D52EBCC34E588D5884.pdf; Supplier: LCSC
U179 = MKDV8GIL-AST: Memory Size:8Gbit Clock Frequency:50MHz Voltage - Supply:2.7V~3.6V Voltage - Supply:2.7V~3.6V Write Cycle Time(tWC):- Page Program time (TPP):- Block Erase Time(tBE):- Data Retention - TDR (Year):- Operating Temperature:-40℃~+85℃ Operating Temperature:-40; LCSC Part Name: 8Gb SD NAND  SDNAND工业级宽温 SLC; Supplier Part: C26159627; Manufacturer: MK(米客方德); Supplier Footprint: LGA-8(6x8); JLCPCB Part Class: Extended Part; Datasheet: https://atta.szlcsc.com/upload/public/pdf/source/20240705/6522E9CE94E018BF06A2CACAEEC15C56.pdf; Supplier: LCSC; Memory Size: 8Gbit; Clock Frequency: 50MHz; Voltage - Supply: 2.7V~3.6V; Operating Temperature: -40℃~+85℃; Interface: SD2.0
U194 = APT2012LZGCK: Illumination Color:Emerald Green Voltage - Forward(Vf):2.65V Voltage - Forward(Vf):2.65V Forward Current:2mA Wavelength - Dominant:525nm Wavelength - Dominant:525nm Peak Wavelength:515nm Lens Color:Water Clear Luminous Intensity:50mcd Luminous Intensity:5; Supplier Part: C5569446; Manufacturer: Kingbright; Supplier Footprint: 0805; JLCPCB Part Class: Extended Part; Datasheet: https://item.szlcsc.com/datasheet/APT2012LZGCK/6487820.html; Supplier: LCSC; Illumination Color: Emerald Green; Voltage - Forward(Vf): 2.65V; Forward Current: 2mA; Wavelength - Dominant: 525nm; Peak Wavelength: 515nm; Lens Color: Water Clear; Luminous Intensity: 50mcd
U195 = DS3231MZ+TRL: Interface:I2C Voltage - Supply:2.3V~5.5V Voltage - Supply:2.3V~5.5V Operating Temperature:-40℃~+85℃ Operating Temperature:-40℃~+85℃; LCSC Part Name: 高精度RTC集成MEMS谐振器; Supplier Part: C107410; Manufacturer: ADI(亚德诺)/MAXIM(美信); Supplier Footprint: SOIC-8; JLCPCB Part Class: Extended Part; Datasheet: https://item.szlcsc.com/datasheet/DS3231MZ%252BTRL/108629.html; Supplier: LCSC; Interface: I2C; Voltage - Supply: 2.3V~5.5V; Operating Temperature: -40℃~+85℃
U196 = CR2032-BS-6: LCSC Part Name: 电池底座 CR2032-BS-6镀金贴板式电池座连接器; Supplier Part: C22363833; Manufacturer: LX(连欣科技); Supplier Footprint: SMD; JLCPCB Part Class: Extended Part; Datasheet: https://atta.szlcsc.com/upload/public/pdf/source/20240319/678C0773FABC2C605DCA22348524B46A.pdf; Supplier: LCSC
U197 = TPSM863252RDXR: Function:Buck Number of Outputs:1 Voltage - Supply:3V~17V Voltage - Supply:3V~17V Output Voltage Accuracy:±1.5% Output Voltage Accuracy:±1.5% Output Voltage:600mV~10V Output Voltage:600mV~10V Output Current(Max):3A Output Current(Max):3A Supply Current (I; Supplier Part: C19632640; Manufacturer: TI(德州仪器); Supplier Footprint: QFN-FCMOD-7(3.3x4); JLCPCB Part Class: Extended Part; Datasheet: https://www.ti.com.cn/cn/lit/ds/symlink/tpsm863252.pdf?ts=1738739465848&ref_url=https%253A%252F%252Fwww.ti.com.cn%252Fsitesearch%252Fzh-cn%252Fdocs%252Funiversalsearch.tsp%253FlangPref%253Dzh-CN%2526nr%253D12%2526searchTerm%253DTPSM863252RDXR; Supplier: LCSC; Function: Buck; Number of Outputs: 1; Voltage - Supply: 3V~17V; Output Voltage Accuracy: ±1.5%; Output Voltage: 600mV~10V; Output Current(Max): 3A; Supply Current (Iq): 100uA; Switching Frequency: 1.2MHz; Ripple Noise: 20mVp-p; Features: Over Current Protection；Over Voltage Protection；Under Voltage Protection；Over Temperature Protection; Length: 4mm; Width: 3.3mm; Height: 2mm; Operating Temperature Range: -40℃~+125℃
U198 = YX-SMD5020: Driver Circuitry:Passive (Externally Driven) Technology:Electromagnetic Voltage - Supply:2V~4V Voltage - Supply:2V~4V Frequency:4kHz Current Consumption:100mA Sound Pressure Level(SPL):75dB Diameter(φD):5mm Length:5mm Width:5mm Height:2mm Operating Temper; Supplier Part: C781883; Manufacturer: YUEXIN(悦馨); JLCPCB Part Class: Extended Part; Datasheet: https://atta.szlcsc.com/upload/public/pdf/source/20220331/DD779B75217AD674C43DBD2DA4F955A6.pdf; Supplier: LCSC; Driver Circuitry: Passive (Externally Driven); Technology: Electromagnetic; Voltage - Supply: 2V~4V; Current Consumption: 100mA; Sound Pressure Level(SPL): 75dB; Diameter(φD): 5mm; Length: 5mm; Width: 5mm; Height: 2mm; Operating Temperature: -30℃~+70℃
USB1 = TYPE-C 16PIN 2MD(073): Connector Type:Type-C Standard:USB 3.1 Gender:Female Mounting Style:Horizontal attachment Number of Contacts:16P Number of Ports:1 Current Rating - Power (Max):5A Operating Temperature Range:-25℃~+85℃ Operating Temperature Range:-25℃~+85℃ Rated Voltage (M; LCSC Part Name: Type-C 母 卧贴; Supplier Part: C2765186; Manufacturer: SHOU HAN(首韩); Supplier Footprint: SMD; JLCPCB Part Class: Extended Part; Datasheet: https://atta.szlcsc.com/upload/public/pdf/source/20211123/39B17C16241EAC15C5E277BDA434118E.pdf; Supplier: LCSC; Connector Type: Type-C; Standard: USB 3.1; Gender: Female; Mounting Style: Horizontal attachment; Number of Contacts: 16P; Number of Ports: 1; Current Rating - Power (Max): 5A; Operating Temperature Range: -25℃~+85℃; Rated Voltage (Max): 5V; Connect-Disconnect Life: 5000 Cuts; Core Colour: Black

## Nets
+3V3: C210.2 C215.2 C228.2 C271.2 C273.2 C278.2 C279.2 R201.1 R202.1 R249.2 R250.2 R251.2 R259.2 RN2.5 RN2.6 RN2.7 RN2.8 RN3.5 RN3.6 RN3.7 RN3.8 U6.2(3V3) U145.8(VDD) U179.8(VDD) U195.2(VCC) U197.3(VOUT) U198.1(+)
+5V: C6.2 D1.2 D19.2(A) R5.2
+48V: C1.2 C2.2 D2.1(K) Q1.3(S2) R2.2 U1.3(VIN) U2.2 U4.9(OUT) U194.1(A)
GND: C1.1 C2.1 C3.1 C5.1 C6.1 C7.2 C210.1 C211.2 C212.2 C214.2 C215.1 C216.1 C228.1 C270.1 C271.1 C273.1 C275.1 C276.1 C277.1 C279.1 CN8.2 CN9.2 D2.2(A) D4.2(GND) D20.2(A) D21.4(GND) J1.1 J2.1 J3.1 J4.1 Q2.2(S) Q2.3(D) R6.1 R7.1 R10.1 R11.1 R12.1 R200.2 R253.1 R257.1 R258.1 U1.1(AGND) U1.2(PGND) U1.8(FPWM) U1.15(EP) U4.7(GND) U6.1(GND) U6.40(GND) U6.41(GND) U97.2 U98.2 U124.1(GND) U145.4(GND) U179.4(GND) U195.5(GND) U196.2 U197.4(PGND) USB1.1(GND) USB1.12(GND)
VBAT: U195.6(VBAT) U196.1
VBUS: C214.1 D4.5(VBUS) D6.2(A) U124.4(V3) U124.16(VCC) USB1.2(VBUS) USB1.11(VBUS)
VCC: C275.2 C276.2 CN9.1 D6.1(C) D19.1(C) D20.1(K) R256.2 U197.1(VIN)
VIN: C7.1 CN8.4 D3.2 Q1.1(S1) U4.2(A) U4.3(VSNS)
32K: RN3.3 U6.14(IO20) U195.1(32kHz)
B: LED21.4(C) U6.8(IO15)
BOOT: C212.1 R201.2 U6.27(IO0) U97.1 U126.3(C)
BST: C4.2 U1.11(BST)
BUZZ: U6.15(IO3) U198.2(-)
CAP: C8.2 U4.11(CAP)
CC1: R12.2 USB1.10(CC2)
CC2: R11.2 USB1.4(CC1)
DGATE: Q1.2(G1) U4.1(DGATE)
DN: D4.3(I/O2) U124.6(D-)
DNN: D4.4(I/O2) USB1.5(DN2) USB1.7(DN1)
DP: D4.1(I/O1) U124.5(D+)
DPP: D4.6(I/O1) USB1.6(DP1) USB1.8(DP2)
DTR: U124.13(DTR#) U125.1(B) U126.2(E)
EARTH: D3.1 USB1.13(SHELL) USB1.14(SHELL)
EN: C211.1 C216.2 R202.2 U6.3(EN) U98.1 U125.3(C)
END: C277.2 R256.1 R257.2 U197.6(EN)
FAN: Q2.1(G) R200.1 U6.12(IO8)
FB3: C278.1 R258.2 R259.1 U197.7(FB)
FB5: R5.1 R6.2 U1.9(FB)
FLAG: U6.11(IO18) U145.1(DQ)
G: LED21.5(C) U6.7(IO7)
HGATE: Q1.4(G2) U4.8(HGATE)
INT: RN3.4 U6.13(IO19) U195.3(INT#/SQW)
LED: R253.2 U194.2(K)
OV: R9.1 R10.2 U4.5(OV)
PWRXD: D21.3(IO1) R254.1 U6.9(IO16)
PWTXD: R255.1 U6.10(IO17)
R: LED21.6(C) U6.6(IO6)
RON: U1.5(RON) U2.1
RSTRTC: U6.33(IO40) U195.4(RST#)
RTS: U124.14(RTS#) U125.2(E) U126.1(B)
RXD: R248.1 U124.3(RXD)
RXD0EP: R209.2 U6.36(RXD0)
RXDPW: CN8.1 R254.2
SCL: RN3.1 U6.4(IO4) U195.8(SCL)
SD_D1: U179.7(DAT1)
SD_D2: U179.1(DAT2)
SDA: RN3.2 U6.5(IO5) U195.7(SDA)
SPI_CLK: RN2.2 U6.35(IO42) U179.3(CLK)
SPI_CS: RN2.1 U6.34(IO41) U179.2(DAT3)
SPI_MISO: RN2.4 U6.32(IO39) U179.6(DAT0)
SPI_MOSI: RN2.3 U6.31(IO38) U179.5(CMD)
SS: C3.2 U1.6(SS)
SW: R9.2 U4.4(SW)
SW1: C4.1 D1.1 U1.12(SW) U1.13(SW)
TXD: R209.1 U124.2(TXD)
TXD0EP: R248.2 U6.37(TXD0)
TXDPW: CN8.3 D21.5(IO2) R255.2
UVLO: R2.1 R7.2 U1.4(EN/UVLO)
VCA: C5.2 U1.10(VCC)
VS: C8.1 C270.2 Q1.5(D2) Q1.6(D2) Q1.7(D1) Q1.8(D1) U4.6(EN/UVLO) U4.10(VS) U4.12(C)
$1N6599: LED21.1(A) R251.1
$1N6600: LED21.2(A) R250.1
$1N6601: LED21.3(A) R249.1

Not connected (* = marked no-connect by the designer): D21 1(NC)* 2(NC)*; U1 7(NC)* 14(NC)*; U4 13(EPAD); U6 16(IO46) 17(IO9) 18(IO10) 19(IO11) 20(IO12) 21(IO13) 22(IO14) 23(IO21) 24(IO47) 25(IO48) 26(IO45) 28(IO35) 29(IO36) 30(IO37) 38(IO2) 39(IO1); U124 7(NC.)* 8(OUT#)* 9(CTS#)* 10(DSR#)* 11(RI#)* 12(DCD#)* 15(R232)*; U145 2(NC)* 3(NC)* 5(NC)* 6(NC)* 7(NC)*; U197 2(SW)* 5(PG)*; U198 3(NC); USB1 3(SBU2)* 9(SBU1)*
